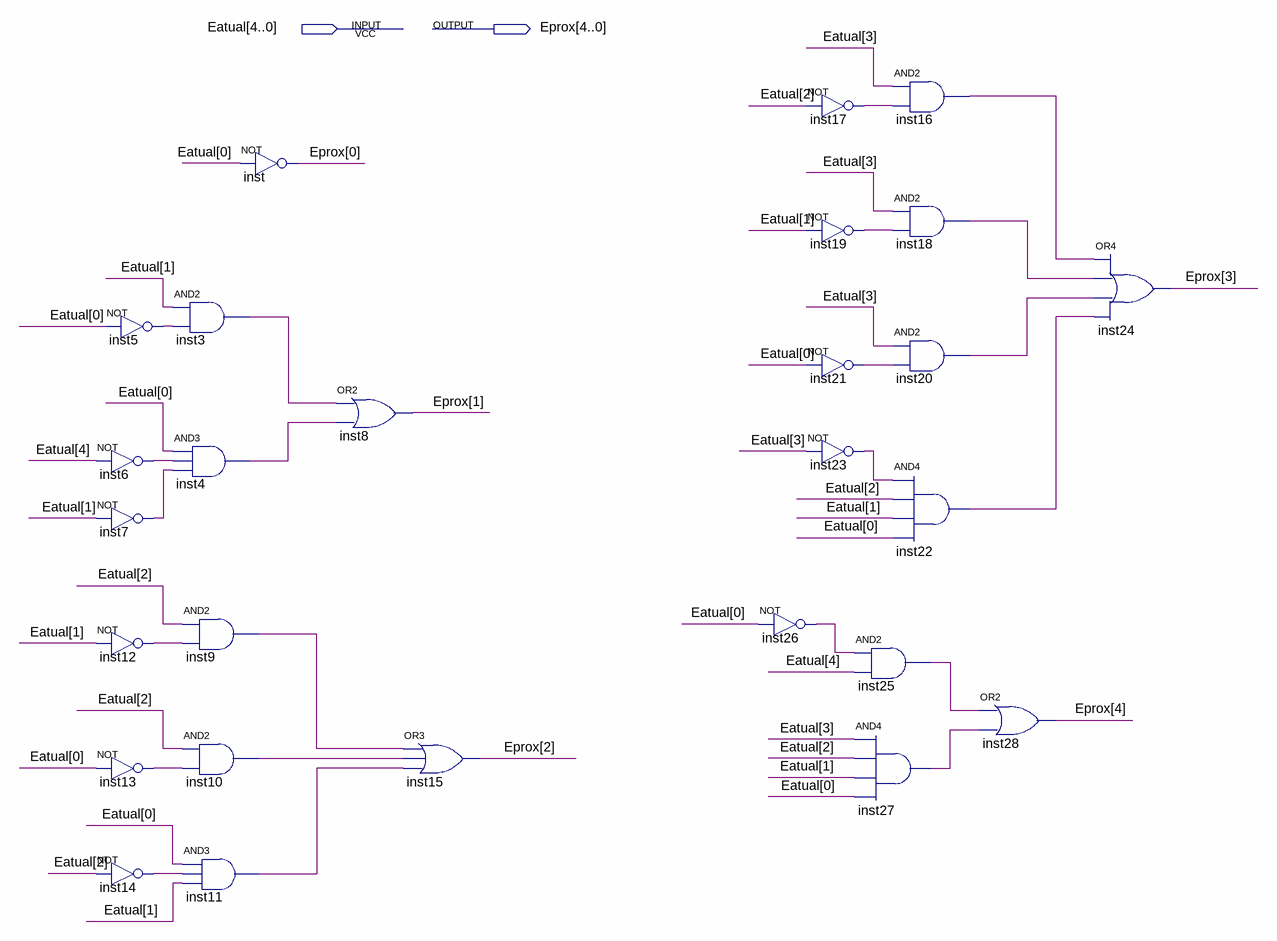
[diagram p0: schematic sheet]
// Quartus schematic ProxEstado.bdf as structural Verilog: 27 symbols, 2 pins
module ProxEstado (
  input  [4:0] Eatual,
  output [4:0] Eprox
);

  wire inst3_out, inst4_out, inst5_out, inst6_out, inst7_out, inst9_out, inst10_out, inst11_out, inst12_out,
       inst13_out, inst14_out, inst16_out, inst17_out, inst18_out, inst19_out, inst20_out, inst21_out,
       inst22_out, inst23_out, inst25_out, inst26_out, inst27_out;

  not inst5 (inst5_out, Eatual[0]);
  not inst6 (inst6_out, Eatual[4]);
  not inst7 (inst7_out, Eatual[1]);
  not inst12 (inst12_out, Eatual[1]);
  not inst13 (inst13_out, Eatual[0]);
  not inst14 (inst14_out, Eatual[2]);
  not inst (Eprox[0], Eatual[0]);
  and inst3 (inst3_out, Eatual[1], inst5_out);
  and inst4 (inst4_out, Eatual[0], inst6_out, inst7_out);
  and inst9 (inst9_out, Eatual[2], inst12_out);
  and inst10 (inst10_out, Eatual[2], inst13_out);
  and inst11 (inst11_out, Eatual[0], inst14_out, Eatual[1]);
  or inst8 (Eprox[1], inst3_out, inst4_out);
  or inst15 (Eprox[2], inst9_out, inst10_out, inst11_out);
  not inst26 (inst26_out, Eatual[0]);
  not inst17 (inst17_out, Eatual[2]);
  not inst19 (inst19_out, Eatual[1]);
  not inst21 (inst21_out, Eatual[0]);
  not inst23 (inst23_out, Eatual[3]);
  and inst25 (inst25_out, inst26_out, Eatual[4]);
  and inst27 (inst27_out, Eatual[3], Eatual[2], Eatual[1], Eatual[0]);
  and inst16 (inst16_out, Eatual[3], inst17_out);
  and inst18 (inst18_out, Eatual[3], inst19_out);
  and inst20 (inst20_out, Eatual[3], inst21_out);
  and inst22 (inst22_out, inst23_out, Eatual[2], Eatual[1], Eatual[0]);
  or inst28 (Eprox[4], inst25_out, inst27_out);
  or inst24 (Eprox[3], inst16_out, inst18_out, inst20_out, inst22_out);
endmodule
